# Altium project pay-optical-tls2591.PrjPCB (part 2 of 2)

## Sheet I2C Mux.SchDoc
size A4; DocumentNumber: 4; SheetNumber: 4; SheetTotal: 8
Used 4 times, as channels I2C_MUX_1, I2C_MUX_2, I2C_MUX_3, I2C_MUX_4. Parts and nets are listed once, with the designators drawn on the sheet.
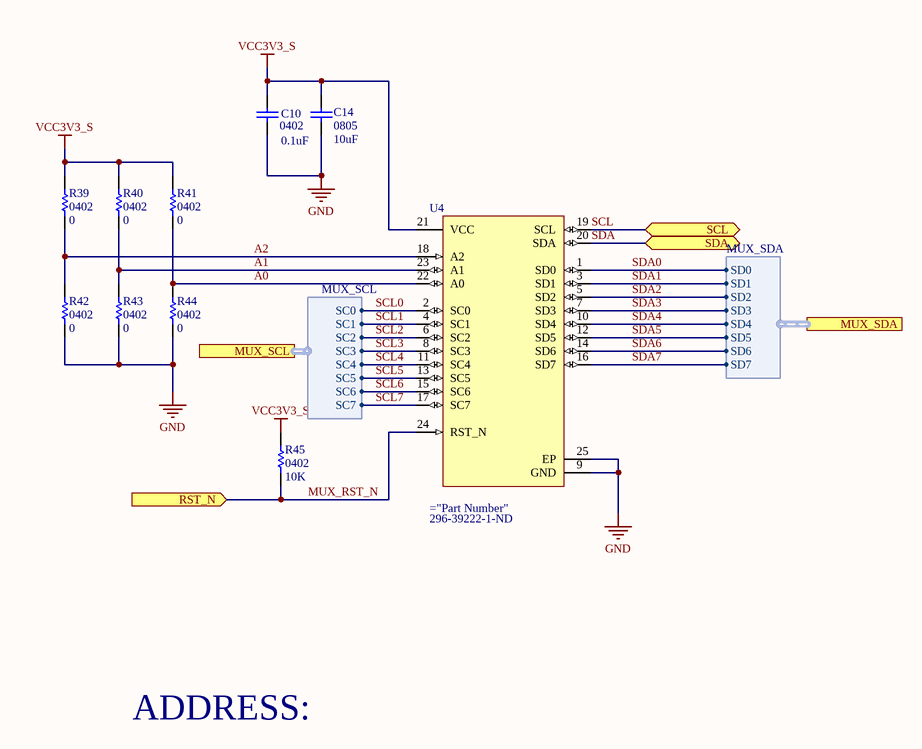
[diagram p6: I2C Mux.SchDoc]

### Parts
C10  0402  value 0.1uF  [CAP0402R]
C14  0805  value 10uF  [CAP0805R]
R39  0402  value 0  [RES0402R]
R40  0402  value 0  [RES0402R]
R41  0402  value 0  [RES0402R]
R42  0402  value 0  [RES0402R]
R43  0402  value 0  [RES0402R]
R44  0402  value 0  [RES0402R]
R45  0402  value 10K  [RES0402R]
U4  Supplier Part Number 1: 296-39222-1-ND  [RGE0024C]  (hidden comment: TCA9548ARGER)

### Ports
MUX_SCL (harness MUX_SCL), MUX_SDA (harness MUX_SDA), RST_N (in), SCL (bidir), SDA (bidir)

### Harnesses
MUX_SCL: SC0, SC1, SC2, SC3, SC4, SC5, SC6, SC7
MUX_SDA: SD0, SD1, SD2, SD3, SD4, SD5, SD6, SD7

### Nets
GND: C10.1 C14.1 R42.1 R43.1 R44.1 U4.9(GND) U4.25(EP)
VCC3V3_S: C10.2 C14.2 R39.2 R40.2 R41.2 R45.2 U4.21(VCC)
A0: R41.1 R44.2 U4.22(A0)
A1: R40.1 R43.2 U4.23(A1)
A2: R39.1 R42.2 U4.18(A2)
MUX_RST_N: R45.1 U4.24(RST_N) ; port RST_N
SCL: U4.19(SCL) ; port SCL
SCL0: U4.2(SC0) ; port MUX_SCL.SC0
SCL1: U4.4(SC1) ; port MUX_SCL.SC1
SCL2: U4.6(SC2) ; port MUX_SCL.SC2
SCL3: U4.8(SC3) ; port MUX_SCL.SC3
SCL4: U4.11(SC4) ; port MUX_SCL.SC4
SCL5: U4.13(SC5) ; port MUX_SCL.SC5
SCL6: U4.15(SC6) ; port MUX_SCL.SC6
SCL7: U4.17(SC7) ; port MUX_SCL.SC7
SDA: U4.20(SDA) ; port SDA
SDA0: U4.1(SD0) ; port MUX_SDA.SD0
SDA1: U4.3(SD1) ; port MUX_SDA.SD1
SDA2: U4.5(SD2) ; port MUX_SDA.SD2
SDA3: U4.7(SD3) ; port MUX_SDA.SD3
SDA4: U4.10(SD4) ; port MUX_SDA.SD4
SDA5: U4.12(SD5) ; port MUX_SDA.SD5
SDA6: U4.14(SD6) ; port MUX_SDA.SD6
SDA7: U4.16(SD7) ; port MUX_SDA.SD7

### Channels
I2C_MUX_1: designators end in _I2C_MUX_1; ports RST_N=MUX1_RST_N SCL=SCL SDA=SDA
I2C_MUX_2: designators end in _I2C_MUX_2; ports RST_N=MUX2_RST_N SCL=SCL SDA=SDA
I2C_MUX_3: designators end in _I2C_MUX_3; ports RST_N=MUX3_RST_N SCL=SCL SDA=SDA
I2C_MUX_4: designators end in _I2C_MUX_4; ports RST_N=MUX4_RST_N SCL=SCL SDA=SDA

### Notes on the sheet
- ADDRESS:

### Library data of the parts
C10 = Cap Semi: Capacitor (Semiconductor SIM Model); Manufacturer: Murata; Manufacturer Part Number: GCM155R71C104KA55J; Capacitance: 100nF; Tolerance: 10%; Voltage Rating: 16V; Dielectric: X7R; Published: 8-Jun-2000; LatestRevisionDate: 29-May-2009; LatestRevisionNote: IPC-7351 Footprint Added.; PackageReference: C1206; Publisher: Altium Limited; PackageDescription: Chip Capacitor; Supplier 1: Digi-Key; Supplier Part Number 1: 587-3807-1-ND; Supplier 2: Digi-Key; Supplier Part Number 2: 490-7998-1-ND; Stock 2: 5962647; Pricing 2: 1=0.1, 10=0.058, 100=0.026, 500=0.01858, 1000=0.0146, 2500=0.01328, 5000=0.01221 (USD); Mount: Surface Mount; Case/Package: 0402; Case Code (Imperial): 0402; Case Code (Metric): 1005; Min Operating Temperature: -55°C; Max Operating Temperature: 125°C; Voltage Rating (DC): 16V; Packaging: Tape and Reel; Package Quantity: 1; Termination: SMD/SMT; Length: 1mm; Height: 0.5mm; Width: 0.5mm; Thickness: 0.022inch; Depth: 0.5mm; Ratings: AEC-Q200; Radiation Hardening: No; Lead Free: Lead Free; ComponentLink1URL: http://psearch.murata.com/capacitor/product/GCM155R71C104KA55%23.pdf?src-supplier=Avnet; ComponentLink1Description: http://psearch.murata.com/capacitor/product/GCM155R71C104KA55%23.pdf?src-supplier=Avnet; ComponentLink2URL: http://www1.futureelectronics.com/doc/MURATA/GCM155R71C104KA55J.pdf?src-supplier=Future+Electronics; ComponentLink2Description: http://www1.futureelectronics.com/doc/MURATA/GCM155R71C104KA55J.pdf?src-supplier=Future+Electronics; ComponentLink3URL: http://psearch.en.murata.com/capacitor/product/GCM155R71C104KA55%23.pdf?src-supplier=Digi-Key; ComponentLink3Description: http://psearch.en.murata.com/capacitor/product/GCM155R71C104KA55%23.pdf?src-supplier=Digi-Key; ComponentLink4URL: http://search.murata.co.jp/Ceramy/image/img/A01X/partnumbering_e_02.pdf?src-supplier=Digi-Key; ComponentLink4Description: http://search.murata.co.jp/Ceramy/image/img/A01X/partnumbering_e_02.pdf?src-supplier=Digi-Key
C14 = Cap: Capacitor; Manufacturer: TDK; Manufacturer Part Number: CGA4J1X7R0J106K125AC; Voltage Rating: 6.3V; Tolerance: 10%; Dielectric: X7R; Published: 8-Jun-2000; LatestRevisionDate: 17-Jul-2002; LatestRevisionNote: Re-released for DXP Platform.; PackageReference: RAD-0.3; Publisher: Altium Limited; PackageDescription: Radial Cap, Thru-Hole; 2 Leads; 0.3 in Pin Spacing; Supplier 1: Digi-Key; Supplier Part Number 1: 445-6971-1-ND; Stock 1: 793917; Pricing 1: 1=0.48, 10=0.331, 100=0.1984, 500=0.14878, 1000=0.12564 (USD); Mount: Surface Mount; Case/Package: 0805; Weight: 0.000194oz; Case Code (Metric): 2012; Case Code (Imperial): 0805; Min Operating Temperature: -55°C; Max Operating Temperature: 125°C; Package Quantity: 1; Capacitance: 10uF; Packaging: Tape and Reel; Voltage Rating (DC): 6.3V; Termination: SMD/SMT; Composition: Ceramic; Length: 2mm; Height: 1.25mm; Width: 0.049inch; Thickness: 0.057inch; Depth: 1.25mm; Ratings: AEC-Q200; REACH SVHC: No SVHC; Lead Free: Lead Free; ComponentLink1URL: http://www.farnell.com/datasheets/1807242.pdf?src-supplier=Element14; ComponentLink1Description: http://www.farnell.com/datasheets/1807242.pdf?src-supplier=Element14; ComponentLink2URL: http://product.tdk.com/capacitor/mlcc/detailed_information.php?lang=en&amp;ref=jp&amp;part_no=CGA4J1X7R0J106K125AC&src-supplier=Mouser; ComponentLink2Description: http://product.tdk.com/capacitor/mlcc/detailed_information.php?lang=en&amp;ref=jp&amp;part_no=CGA4J1X7R0J106K125AC&src-supplier=Mouser
R39-R44 = Res1: Resistor; Manufacturer: Panasonic; Manufacturer Part Number: ERJ2GE0R00X; Resistance: 0mR; Power Rating: 100mW; Voltage Rating: 50V; Tolerance: 5%; Temperature Coefficient: 600ppm/°C; Published: 8-Jun-2000; LatestRevisionDate: 17-Jul-2002; LatestRevisionNote: Re-released for DXP Platform.; PackageReference: AXIAL-0.3; Publisher: Altium Limited; PackageDescription: Axial Device, Thru-Hole; 2 Leads; 0.3 in Pin Spacing; Supplier 1: Digi-Key; Supplier 2: Digi-Key; Supplier Part Number 2: P0.0JCT-ND; Stock 2: 51531353; Pricing 2: 1=0.1, 10=0.03, 25=0.0216, 50=0.0164, 100=0.0121, 250=0.00924, 500=0.0074, 1000=0.00545, 5000=0.00391 (USD); Mount: Surface Mount; Case/Package: 0402; Case Code (Metric): 1005; Case Code (Imperial): 0402; Contact Plating: Tin; Min Operating Temperature: -55°C; Max Operating Temperature: 155°C; Packaging: Tape and Reel; Package Quantity: 1; Composition: Thick Film; Number of Terminations: 2; Termination: SMD/SMT; Military Standard: Not; Max Power Dissipation: 100mW; Voltage Rating (DC): 50V; Features: Automotive AEC-Q200; Length: 1mm; Height: 0.35mm; Width: 0.02inch; Depth: 0.5mm; Radiation Hardening: No; REACH SVHC: No SVHC; Lead Free: Lead Free; ComponentLink1URL: http://industrial.panasonic.com/www-data/pdf/AOA0000/AOA0000CE1.pdf?src-supplier=Avnet; ComponentLink1Description: http://industrial.panasonic.com/www-data/pdf/AOA0000/AOA0000CE1.pdf?src-supplier=Avnet; ComponentLink2URL: http://www.alliedelec.com/m/d/51cd0790071e1666bdb9d00c57fcf960.pdf?src-supplier=Allied+Electronics; ComponentLink2Description: http://www.alliedelec.com/m/d/51cd0790071e1666bdb9d00c57fcf960.pdf?src-supplier=Allied+Electronics; ComponentLink3URL: http://industrial.panasonic.com/www-data/pdf/AOA0000/AOA0000CE1.pdf?src-supplier=Avnet+Europe; ComponentLink3Description: http://industrial.panasonic.com/www-data/pdf/AOA0000/AOA0000CE1.pdf?src-supplier=Avnet+Europe; ComponentLink4URL: http://www.farnell.com/datasheets/2059623.pdf?src-supplier=Farnell; ComponentLink4Description: http://www.farnell.com/datasheets/2059623.pdf?src-supplier=Farnell; ComponentLink5URL: http://www.farnell.com/datasheets/1678796.pdf?src-supplier=Element14; ComponentLink5Description: http://www.farnell.com/datasheets/1678796.pdf?src-supplier=Element14; ComponentLink6URL: http://www.farnell.com/datasheets/2059623.pdf?src-supplier=Element14; ComponentLink6Description: http://www.farnell.com/datasheets/2059623.pdf?src-supplier=Element14
R45 = Res1: Resistor; Published: 8-Jun-2000; LatestRevisionDate: 17-Jul-2002; LatestRevisionNote: Re-released for DXP Platform.; PackageReference: AXIAL-0.3; Publisher: Altium Limited; PackageDescription: Axial Device, Thru-Hole; 2 Leads; 0.3 in Pin Spacing; Supplier 1: Digi-Key
U4 = TCA9548ARGER: Supplier 1: Digi-Key

## Nets that join several sheets
GND: TOP (16 pins), ATMEGA8A (13 pins), Power (11 pins), SENS1/TSL2591_1 (C11_SENS1_TSL2591_1.1 C13_SENS1_TSL2591_1.1 D7_SENS1_TSL2591_1.2 U6_SENS1_TSL2591_1.3), SENS1/TSL2591_2 (C11_SENS1_TSL2591_2.1 C13_SENS1_TSL2591_2.1 D7_SENS1_TSL2591_2.2 U6_SENS1_TSL2591_2.3), SENS1/TSL2591_3 (C11_SENS1_TSL2591_3.1 C13_SENS1_TSL2591_3.1 D7_SENS1_TSL2591_3.2 U6_SENS1_TSL2591_3.3), SENS1/TSL2591_4 (C11_SENS1_TSL2591_4.1 C13_SENS1_TSL2591_4.1 D7_SENS1_TSL2591_4.2 U6_SENS1_TSL2591_4.3), SENS1/TSL2591_5 (C11_SENS1_TSL2591_5.1 C13_SENS1_TSL2591_5.1 D7_SENS1_TSL2591_5.2 U6_SENS1_TSL2591_5.3), SENS1/TSL2591_6 (C11_SENS1_TSL2591_6.1 C13_SENS1_TSL2591_6.1 D7_SENS1_TSL2591_6.2 U6_SENS1_TSL2591_6.3), SENS1/TSL2591_7 (C11_SENS1_TSL2591_7.1 C13_SENS1_TSL2591_7.1 D7_SENS1_TSL2591_7.2 U6_SENS1_TSL2591_7.3), SENS1/TSL2591_8 (C11_SENS1_TSL2591_8.1 C13_SENS1_TSL2591_8.1 D7_SENS1_TSL2591_8.2 U6_SENS1_TSL2591_8.3), SENS2/TSL2591_1 (C11_SENS2_TSL2591_1.1 C13_SENS2_TSL2591_1.1 D7_SENS2_TSL2591_1.2 U6_SENS2_TSL2591_1.3), SENS2/TSL2591_2 (C11_SENS2_TSL2591_2.1 C13_SENS2_TSL2591_2.1 D7_SENS2_TSL2591_2.2 U6_SENS2_TSL2591_2.3), SENS2/TSL2591_3 (C11_SENS2_TSL2591_3.1 C13_SENS2_TSL2591_3.1 D7_SENS2_TSL2591_3.2 U6_SENS2_TSL2591_3.3), SENS2/TSL2591_4 (C11_SENS2_TSL2591_4.1 C13_SENS2_TSL2591_4.1 D7_SENS2_TSL2591_4.2 U6_SENS2_TSL2591_4.3), SENS2/TSL2591_5 (C11_SENS2_TSL2591_5.1 C13_SENS2_TSL2591_5.1 D7_SENS2_TSL2591_5.2 U6_SENS2_TSL2591_5.3), SENS2/TSL2591_6 (C11_SENS2_TSL2591_6.1 C13_SENS2_TSL2591_6.1 D7_SENS2_TSL2591_6.2 U6_SENS2_TSL2591_6.3), SENS2/TSL2591_7 (C11_SENS2_TSL2591_7.1 C13_SENS2_TSL2591_7.1 D7_SENS2_TSL2591_7.2 U6_SENS2_TSL2591_7.3), SENS2/TSL2591_8 (C11_SENS2_TSL2591_8.1 C13_SENS2_TSL2591_8.1 D7_SENS2_TSL2591_8.2 U6_SENS2_TSL2591_8.3), SENS3/TSL2591_1 (C11_SENS3_TSL2591_1.1 C13_SENS3_TSL2591_1.1 D7_SENS3_TSL2591_1.2 U6_SENS3_TSL2591_1.3), SENS3/TSL2591_2 (C11_SENS3_TSL2591_2.1 C13_SENS3_TSL2591_2.1 D7_SENS3_TSL2591_2.2 U6_SENS3_TSL2591_2.3), SENS3/TSL2591_3 (C11_SENS3_TSL2591_3.1 C13_SENS3_TSL2591_3.1 D7_SENS3_TSL2591_3.2 U6_SENS3_TSL2591_3.3), SENS3/TSL2591_4 (C11_SENS3_TSL2591_4.1 C13_SENS3_TSL2591_4.1 D7_SENS3_TSL2591_4.2 U6_SENS3_TSL2591_4.3), SENS3/TSL2591_5 (C11_SENS3_TSL2591_5.1 C13_SENS3_TSL2591_5.1 D7_SENS3_TSL2591_5.2 U6_SENS3_TSL2591_5.3), SENS3/TSL2591_6 (C11_SENS3_TSL2591_6.1 C13_SENS3_TSL2591_6.1 D7_SENS3_TSL2591_6.2 U6_SENS3_TSL2591_6.3), SENS3/TSL2591_7 (C11_SENS3_TSL2591_7.1 C13_SENS3_TSL2591_7.1 D7_SENS3_TSL2591_7.2 U6_SENS3_TSL2591_7.3), SENS3/TSL2591_8 (C11_SENS3_TSL2591_8.1 C13_SENS3_TSL2591_8.1 D7_SENS3_TSL2591_8.2 U6_SENS3_TSL2591_8.3), SENS4/TSL2591_1 (C11_SENS4_TSL2591_1.1 C13_SENS4_TSL2591_1.1 D7_SENS4_TSL2591_1.2 U6_SENS4_TSL2591_1.3), SENS4/TSL2591_2 (C11_SENS4_TSL2591_2.1 C13_SENS4_TSL2591_2.1 D7_SENS4_TSL2591_2.2 U6_SENS4_TSL2591_2.3), SENS4/TSL2591_3 (C11_SENS4_TSL2591_3.1 C13_SENS4_TSL2591_3.1 D7_SENS4_TSL2591_3.2 U6_SENS4_TSL2591_3.3), SENS4/TSL2591_4 (C11_SENS4_TSL2591_4.1 C13_SENS4_TSL2591_4.1 D7_SENS4_TSL2591_4.2 U6_SENS4_TSL2591_4.3), SENS4/TSL2591_5 (C11_SENS4_TSL2591_5.1 C13_SENS4_TSL2591_5.1 D7_SENS4_TSL2591_5.2 U6_SENS4_TSL2591_5.3), SENS4/TSL2591_6 (C11_SENS4_TSL2591_6.1 C13_SENS4_TSL2591_6.1 D7_SENS4_TSL2591_6.2 U6_SENS4_TSL2591_6.3), SENS4/TSL2591_7 (C11_SENS4_TSL2591_7.1 C13_SENS4_TSL2591_7.1 D7_SENS4_TSL2591_7.2 U6_SENS4_TSL2591_7.3), SENS4/TSL2591_8 (C11_SENS4_TSL2591_8.1 C13_SENS4_TSL2591_8.1 D7_SENS4_TSL2591_8.2 U6_SENS4_TSL2591_8.3), PEX1 (7 pins), PEX2 (7 pins), I2C_MUX_1 (7 pins), I2C_MUX_2 (7 pins), I2C_MUX_3 (7 pins), I2C_MUX_4 (7 pins)
VCC3V3: TOP (J2.2), ATMEGA8A (8 pins), Power (10 pins)
VCC3V3_S: TOP (5 pins), ATMEGA8A (U1.22), Power (C18.2 R27.1 U2.7 U2.8), SENS1/TSL2591_1 (5 pins), SENS1/TSL2591_2 (5 pins), SENS1/TSL2591_3 (5 pins), SENS1/TSL2591_4 (5 pins), SENS1/TSL2591_5 (5 pins), SENS1/TSL2591_6 (5 pins), SENS1/TSL2591_7 (5 pins), SENS1/TSL2591_8 (5 pins), SENS2/TSL2591_1 (5 pins), SENS2/TSL2591_2 (5 pins), SENS2/TSL2591_3 (5 pins), SENS2/TSL2591_4 (5 pins), SENS2/TSL2591_5 (5 pins), SENS2/TSL2591_6 (5 pins), SENS2/TSL2591_7 (5 pins), SENS2/TSL2591_8 (5 pins), SENS3/TSL2591_1 (5 pins), SENS3/TSL2591_2 (5 pins), SENS3/TSL2591_3 (5 pins), SENS3/TSL2591_4 (5 pins), SENS3/TSL2591_5 (5 pins), SENS3/TSL2591_6 (5 pins), SENS3/TSL2591_7 (5 pins), SENS3/TSL2591_8 (5 pins), SENS4/TSL2591_1 (5 pins), SENS4/TSL2591_2 (5 pins), SENS4/TSL2591_3 (5 pins), SENS4/TSL2591_4 (5 pins), SENS4/TSL2591_5 (5 pins), SENS4/TSL2591_6 (5 pins), SENS4/TSL2591_7 (5 pins), SENS4/TSL2591_8 (5 pins), PEX1 (7 pins), PEX2 (7 pins), I2C_MUX_1 (7 pins), I2C_MUX_2 (7 pins), I2C_MUX_3 (7 pins), I2C_MUX_4 (7 pins)
VIN: TOP (J3.2 J3.19), Power (C17.2 L1.1)
CS_N: TOP (J2.13 R17.2), ATMEGA8A (R3.1 U1.14)
CURR_SENSE: ATMEGA8A (U1.19), Power (U7.6)
DATA_RDY: TOP (J2.5 R16.1), ATMEGA8A (U1.11)
LED1: SENS1/TSL2591_1 (R24_SENS1_TSL2591_1.1), PEX1 (U5_PEX1.25)
LED1: SENS2/TSL2591_1 (R24_SENS2_TSL2591_1.1), PEX1 (U5_PEX1.17)
LED1: SENS3/TSL2591_1 (R24_SENS3_TSL2591_1.1), PEX2 (U5_PEX2.25)
LED1: SENS4/TSL2591_1 (R24_SENS4_TSL2591_1.1), PEX2 (U5_PEX2.17)
LED2: SENS1/TSL2591_2 (R24_SENS1_TSL2591_2.1), PEX1 (U5_PEX1.26)
LED2: SENS2/TSL2591_2 (R24_SENS2_TSL2591_2.1), PEX1 (U5_PEX1.18)
LED2: SENS3/TSL2591_2 (R24_SENS3_TSL2591_2.1), PEX2 (U5_PEX2.26)
LED2: SENS4/TSL2591_2 (R24_SENS4_TSL2591_2.1), PEX2 (U5_PEX2.18)
LED3: SENS1/TSL2591_3 (R24_SENS1_TSL2591_3.1), PEX1 (U5_PEX1.27)
LED3: SENS2/TSL2591_3 (R24_SENS2_TSL2591_3.1), PEX1 (U5_PEX1.19)
LED3: SENS3/TSL2591_3 (R24_SENS3_TSL2591_3.1), PEX2 (U5_PEX2.27)
LED3: SENS4/TSL2591_3 (R24_SENS4_TSL2591_3.1), PEX2 (U5_PEX2.19)
LED4: SENS1/TSL2591_4 (R24_SENS1_TSL2591_4.1), PEX1 (U5_PEX1.28)
LED4: SENS2/TSL2591_4 (R24_SENS2_TSL2591_4.1), PEX1 (U5_PEX1.20)
LED4: SENS3/TSL2591_4 (R24_SENS3_TSL2591_4.1), PEX2 (U5_PEX2.28)
LED4: SENS4/TSL2591_4 (R24_SENS4_TSL2591_4.1), PEX2 (U5_PEX2.20)
LED5: SENS1/TSL2591_5 (R24_SENS1_TSL2591_5.1), PEX1 (U5_PEX1.1)
LED5: SENS2/TSL2591_5 (R24_SENS2_TSL2591_5.1), PEX1 (U5_PEX1.21)
LED5: SENS3/TSL2591_5 (R24_SENS3_TSL2591_5.1), PEX2 (U5_PEX2.1)
LED5: SENS4/TSL2591_5 (R24_SENS4_TSL2591_5.1), PEX2 (U5_PEX2.21)
LED6: SENS1/TSL2591_6 (R24_SENS1_TSL2591_6.1), PEX1 (U5_PEX1.2)
LED6: SENS2/TSL2591_6 (R24_SENS2_TSL2591_6.1), PEX1 (U5_PEX1.22)
LED6: SENS3/TSL2591_6 (R24_SENS3_TSL2591_6.1), PEX2 (U5_PEX2.2)
LED6: SENS4/TSL2591_6 (R24_SENS4_TSL2591_6.1), PEX2 (U5_PEX2.22)
LED7: SENS1/TSL2591_7 (R24_SENS1_TSL2591_7.1), PEX1 (U5_PEX1.3)
LED7: SENS2/TSL2591_7 (R24_SENS2_TSL2591_7.1), PEX1 (U5_PEX1.23)
LED7: SENS3/TSL2591_7 (R24_SENS3_TSL2591_7.1), PEX2 (U5_PEX2.3)
LED7: SENS4/TSL2591_7 (R24_SENS4_TSL2591_7.1), PEX2 (U5_PEX2.23)
LED8: SENS1/TSL2591_8 (R24_SENS1_TSL2591_8.1), PEX1 (U5_PEX1.4)
LED8: SENS2/TSL2591_8 (R24_SENS2_TSL2591_8.1), PEX1 (U5_PEX1.24)
LED8: SENS3/TSL2591_8 (R24_SENS3_TSL2591_8.1), PEX2 (U5_PEX2.4)
LED8: SENS4/TSL2591_8 (R24_SENS4_TSL2591_8.1), PEX2 (U5_PEX2.24)
MISO: TOP (J2.7 R20.1), ATMEGA8A (J1.1 U1.16)
MOSI: TOP (J2.9 R18.1), ATMEGA8A (J1.4 U1.15)
MUX1_RST_N: ATMEGA8A (U1.26), I2C_MUX_1 (R45_I2C_MUX_1.1 U4_I2C_MUX_1.24)
MUX2_RST_N: ATMEGA8A (U1.25), I2C_MUX_2 (R45_I2C_MUX_2.1 U4_I2C_MUX_2.24)
MUX3_RST_N: ATMEGA8A (U1.24), I2C_MUX_3 (R45_I2C_MUX_3.1 U4_I2C_MUX_3.24)
MUX4_RST_N: ATMEGA8A (U1.23), I2C_MUX_4 (R45_I2C_MUX_4.1 U4_I2C_MUX_4.24)
RST_N: TOP (J2.14 R19.2), ATMEGA8A (J1.5 R2.1 S1.1 U1.29)
RX: TOP (J2.3), ATMEGA8A (U1.30)
SCK: TOP (J2.11 R21.1), ATMEGA8A (J1.3 U1.17)
SCL: TOP (J2.12 LED1.4 LED2.4 R15.1), ATMEGA8A (U1.28), PEX1 (U5_PEX1.8), PEX2 (U5_PEX2.8), I2C_MUX_1 (U4_I2C_MUX_1.19), I2C_MUX_2 (U4_I2C_MUX_2.19), I2C_MUX_3 (U4_I2C_MUX_3.19), I2C_MUX_4 (U4_I2C_MUX_4.19)
SCL0: SENS1/TSL2591_1 (R23_SENS1_TSL2591_1.1 U6_SENS1_TSL2591_1.1), I2C_MUX_1 (U4_I2C_MUX_1.2)
SCL0: SENS2/TSL2591_1 (R23_SENS2_TSL2591_1.1 U6_SENS2_TSL2591_1.1), I2C_MUX_2 (U4_I2C_MUX_2.2)
SCL0: SENS3/TSL2591_1 (R23_SENS3_TSL2591_1.1 U6_SENS3_TSL2591_1.1), I2C_MUX_3 (U4_I2C_MUX_3.2)
SCL0: SENS4/TSL2591_1 (R23_SENS4_TSL2591_1.1 U6_SENS4_TSL2591_1.1), I2C_MUX_4 (U4_I2C_MUX_4.2)
SCL1: SENS1/TSL2591_2 (R23_SENS1_TSL2591_2.1 U6_SENS1_TSL2591_2.1), I2C_MUX_1 (U4_I2C_MUX_1.4)
SCL1: SENS2/TSL2591_2 (R23_SENS2_TSL2591_2.1 U6_SENS2_TSL2591_2.1), I2C_MUX_2 (U4_I2C_MUX_2.4)
SCL1: SENS3/TSL2591_2 (R23_SENS3_TSL2591_2.1 U6_SENS3_TSL2591_2.1), I2C_MUX_3 (U4_I2C_MUX_3.4)
SCL1: SENS4/TSL2591_2 (R23_SENS4_TSL2591_2.1 U6_SENS4_TSL2591_2.1), I2C_MUX_4 (U4_I2C_MUX_4.4)
SCL2: SENS1/TSL2591_3 (R23_SENS1_TSL2591_3.1 U6_SENS1_TSL2591_3.1), I2C_MUX_1 (U4_I2C_MUX_1.6)
SCL2: SENS2/TSL2591_3 (R23_SENS2_TSL2591_3.1 U6_SENS2_TSL2591_3.1), I2C_MUX_2 (U4_I2C_MUX_2.6)
SCL2: SENS3/TSL2591_3 (R23_SENS3_TSL2591_3.1 U6_SENS3_TSL2591_3.1), I2C_MUX_3 (U4_I2C_MUX_3.6)
SCL2: SENS4/TSL2591_3 (R23_SENS4_TSL2591_3.1 U6_SENS4_TSL2591_3.1), I2C_MUX_4 (U4_I2C_MUX_4.6)
SCL3: SENS1/TSL2591_4 (R23_SENS1_TSL2591_4.1 U6_SENS1_TSL2591_4.1), I2C_MUX_1 (U4_I2C_MUX_1.8)
SCL3: SENS2/TSL2591_4 (R23_SENS2_TSL2591_4.1 U6_SENS2_TSL2591_4.1), I2C_MUX_2 (U4_I2C_MUX_2.8)
SCL3: SENS3/TSL2591_4 (R23_SENS3_TSL2591_4.1 U6_SENS3_TSL2591_4.1), I2C_MUX_3 (U4_I2C_MUX_3.8)
SCL3: SENS4/TSL2591_4 (R23_SENS4_TSL2591_4.1 U6_SENS4_TSL2591_4.1), I2C_MUX_4 (U4_I2C_MUX_4.8)
SCL4: SENS1/TSL2591_5 (R23_SENS1_TSL2591_5.1 U6_SENS1_TSL2591_5.1), I2C_MUX_1 (U4_I2C_MUX_1.11)
SCL4: SENS2/TSL2591_5 (R23_SENS2_TSL2591_5.1 U6_SENS2_TSL2591_5.1), I2C_MUX_2 (U4_I2C_MUX_2.11)
SCL4: SENS3/TSL2591_5 (R23_SENS3_TSL2591_5.1 U6_SENS3_TSL2591_5.1), I2C_MUX_3 (U4_I2C_MUX_3.11)
SCL4: SENS4/TSL2591_5 (R23_SENS4_TSL2591_5.1 U6_SENS4_TSL2591_5.1), I2C_MUX_4 (U4_I2C_MUX_4.11)
SCL5: SENS1/TSL2591_6 (R23_SENS1_TSL2591_6.1 U6_SENS1_TSL2591_6.1), I2C_MUX_1 (U4_I2C_MUX_1.13)
SCL5: SENS2/TSL2591_6 (R23_SENS2_TSL2591_6.1 U6_SENS2_TSL2591_6.1), I2C_MUX_2 (U4_I2C_MUX_2.13)
SCL5: SENS3/TSL2591_6 (R23_SENS3_TSL2591_6.1 U6_SENS3_TSL2591_6.1), I2C_MUX_3 (U4_I2C_MUX_3.13)
SCL5: SENS4/TSL2591_6 (R23_SENS4_TSL2591_6.1 U6_SENS4_TSL2591_6.1), I2C_MUX_4 (U4_I2C_MUX_4.13)
SCL6: SENS1/TSL2591_7 (R23_SENS1_TSL2591_7.1 U6_SENS1_TSL2591_7.1), I2C_MUX_1 (U4_I2C_MUX_1.15)
SCL6: SENS2/TSL2591_7 (R23_SENS2_TSL2591_7.1 U6_SENS2_TSL2591_7.1), I2C_MUX_2 (U4_I2C_MUX_2.15)
SCL6: SENS3/TSL2591_7 (R23_SENS3_TSL2591_7.1 U6_SENS3_TSL2591_7.1), I2C_MUX_3 (U4_I2C_MUX_3.15)
SCL6: SENS4/TSL2591_7 (R23_SENS4_TSL2591_7.1 U6_SENS4_TSL2591_7.1), I2C_MUX_4 (U4_I2C_MUX_4.15)
SCL7: SENS1/TSL2591_8 (R23_SENS1_TSL2591_8.1 U6_SENS1_TSL2591_8.1), I2C_MUX_1 (U4_I2C_MUX_1.17)
SCL7: SENS2/TSL2591_8 (R23_SENS2_TSL2591_8.1 U6_SENS2_TSL2591_8.1), I2C_MUX_2 (U4_I2C_MUX_2.17)
SCL7: SENS3/TSL2591_8 (R23_SENS3_TSL2591_8.1 U6_SENS3_TSL2591_8.1), I2C_MUX_3 (U4_I2C_MUX_3.17)
SCL7: SENS4/TSL2591_8 (R23_SENS4_TSL2591_8.1 U6_SENS4_TSL2591_8.1), I2C_MUX_4 (U4_I2C_MUX_4.17)
SDA: TOP (J2.10 LED1.3 LED2.3 R14.1), ATMEGA8A (U1.27), PEX1 (U5_PEX1.9), PEX2 (U5_PEX2.9), I2C_MUX_1 (U4_I2C_MUX_1.20), I2C_MUX_2 (U4_I2C_MUX_2.20), I2C_MUX_3 (U4_I2C_MUX_3.20), I2C_MUX_4 (U4_I2C_MUX_4.20)
SDA0: SENS1/TSL2591_1 (R22_SENS1_TSL2591_1.1 U6_SENS1_TSL2591_1.6), I2C_MUX_1 (U4_I2C_MUX_1.1)
SDA0: SENS2/TSL2591_1 (R22_SENS2_TSL2591_1.1 U6_SENS2_TSL2591_1.6), I2C_MUX_2 (U4_I2C_MUX_2.1)
SDA0: SENS3/TSL2591_1 (R22_SENS3_TSL2591_1.1 U6_SENS3_TSL2591_1.6), I2C_MUX_3 (U4_I2C_MUX_3.1)
SDA0: SENS4/TSL2591_1 (R22_SENS4_TSL2591_1.1 U6_SENS4_TSL2591_1.6), I2C_MUX_4 (U4_I2C_MUX_4.1)
SDA1: SENS1/TSL2591_2 (R22_SENS1_TSL2591_2.1 U6_SENS1_TSL2591_2.6), I2C_MUX_1 (U4_I2C_MUX_1.3)
SDA1: SENS2/TSL2591_2 (R22_SENS2_TSL2591_2.1 U6_SENS2_TSL2591_2.6), I2C_MUX_2 (U4_I2C_MUX_2.3)
SDA1: SENS3/TSL2591_2 (R22_SENS3_TSL2591_2.1 U6_SENS3_TSL2591_2.6), I2C_MUX_3 (U4_I2C_MUX_3.3)
SDA1: SENS4/TSL2591_2 (R22_SENS4_TSL2591_2.1 U6_SENS4_TSL2591_2.6), I2C_MUX_4 (U4_I2C_MUX_4.3)
SDA2: SENS1/TSL2591_3 (R22_SENS1_TSL2591_3.1 U6_SENS1_TSL2591_3.6), I2C_MUX_1 (U4_I2C_MUX_1.5)
SDA2: SENS2/TSL2591_3 (R22_SENS2_TSL2591_3.1 U6_SENS2_TSL2591_3.6), I2C_MUX_2 (U4_I2C_MUX_2.5)
SDA2: SENS3/TSL2591_3 (R22_SENS3_TSL2591_3.1 U6_SENS3_TSL2591_3.6), I2C_MUX_3 (U4_I2C_MUX_3.5)
SDA2: SENS4/TSL2591_3 (R22_SENS4_TSL2591_3.1 U6_SENS4_TSL2591_3.6), I2C_MUX_4 (U4_I2C_MUX_4.5)
SDA3: SENS1/TSL2591_4 (R22_SENS1_TSL2591_4.1 U6_SENS1_TSL2591_4.6), I2C_MUX_1 (U4_I2C_MUX_1.7)
SDA3: SENS2/TSL2591_4 (R22_SENS2_TSL2591_4.1 U6_SENS2_TSL2591_4.6), I2C_MUX_2 (U4_I2C_MUX_2.7)
SDA3: SENS3/TSL2591_4 (R22_SENS3_TSL2591_4.1 U6_SENS3_TSL2591_4.6), I2C_MUX_3 (U4_I2C_MUX_3.7)
SDA3: SENS4/TSL2591_4 (R22_SENS4_TSL2591_4.1 U6_SENS4_TSL2591_4.6), I2C_MUX_4 (U4_I2C_MUX_4.7)
SDA4: SENS1/TSL2591_5 (R22_SENS1_TSL2591_5.1 U6_SENS1_TSL2591_5.6), I2C_MUX_1 (U4_I2C_MUX_1.10)
SDA4: SENS2/TSL2591_5 (R22_SENS2_TSL2591_5.1 U6_SENS2_TSL2591_5.6), I2C_MUX_2 (U4_I2C_MUX_2.10)
SDA4: SENS3/TSL2591_5 (R22_SENS3_TSL2591_5.1 U6_SENS3_TSL2591_5.6), I2C_MUX_3 (U4_I2C_MUX_3.10)
SDA4: SENS4/TSL2591_5 (R22_SENS4_TSL2591_5.1 U6_SENS4_TSL2591_5.6), I2C_MUX_4 (U4_I2C_MUX_4.10)
SDA5: SENS1/TSL2591_6 (R22_SENS1_TSL2591_6.1 U6_SENS1_TSL2591_6.6), I2C_MUX_1 (U4_I2C_MUX_1.12)
SDA5: SENS2/TSL2591_6 (R22_SENS2_TSL2591_6.1 U6_SENS2_TSL2591_6.6), I2C_MUX_2 (U4_I2C_MUX_2.12)
SDA5: SENS3/TSL2591_6 (R22_SENS3_TSL2591_6.1 U6_SENS3_TSL2591_6.6), I2C_MUX_3 (U4_I2C_MUX_3.12)
SDA5: SENS4/TSL2591_6 (R22_SENS4_TSL2591_6.1 U6_SENS4_TSL2591_6.6), I2C_MUX_4 (U4_I2C_MUX_4.12)
SDA6: SENS1/TSL2591_7 (R22_SENS1_TSL2591_7.1 U6_SENS1_TSL2591_7.6), I2C_MUX_1 (U4_I2C_MUX_1.14)
SDA6: SENS2/TSL2591_7 (R22_SENS2_TSL2591_7.1 U6_SENS2_TSL2591_7.6), I2C_MUX_2 (U4_I2C_MUX_2.14)
SDA6: SENS3/TSL2591_7 (R22_SENS3_TSL2591_7.1 U6_SENS3_TSL2591_7.6), I2C_MUX_3 (U4_I2C_MUX_3.14)
SDA6: SENS4/TSL2591_7 (R22_SENS4_TSL2591_7.1 U6_SENS4_TSL2591_7.6), I2C_MUX_4 (U4_I2C_MUX_4.14)
SDA7: SENS1/TSL2591_8 (R22_SENS1_TSL2591_8.1 U6_SENS1_TSL2591_8.6), I2C_MUX_1 (U4_I2C_MUX_1.16)
SDA7: SENS2/TSL2591_8 (R22_SENS2_TSL2591_8.1 U6_SENS2_TSL2591_8.6), I2C_MUX_2 (U4_I2C_MUX_2.16)
SDA7: SENS3/TSL2591_8 (R22_SENS3_TSL2591_8.1 U6_SENS3_TSL2591_8.6), I2C_MUX_3 (U4_I2C_MUX_3.16)
SDA7: SENS4/TSL2591_8 (R22_SENS4_TSL2591_8.1 U6_SENS4_TSL2591_8.6), I2C_MUX_4 (U4_I2C_MUX_4.16)
TX: TOP (J2.1), ATMEGA8A (U1.31)
VCC_EN: ATMEGA8A (U1.13), Power (R25.1 U2.3)